# Altium schematic sheet tie-mib-imib.SchDoc: Copper Suicide - Net Tie IMIB
size Letter; CheckedBy: J. Brinton; CompanyName: Signal Laboratories, Inc.; DrawnBy: J. Brinton; Engineer: J. Brinton; Address1: 3479 Edison Way; Address2: Menlo Park CA 94025; Address3: +1 (877) 778-8435; Address4: siglabs.com; Revision: 3; SheetNumber: 30; SheetTotal: 47
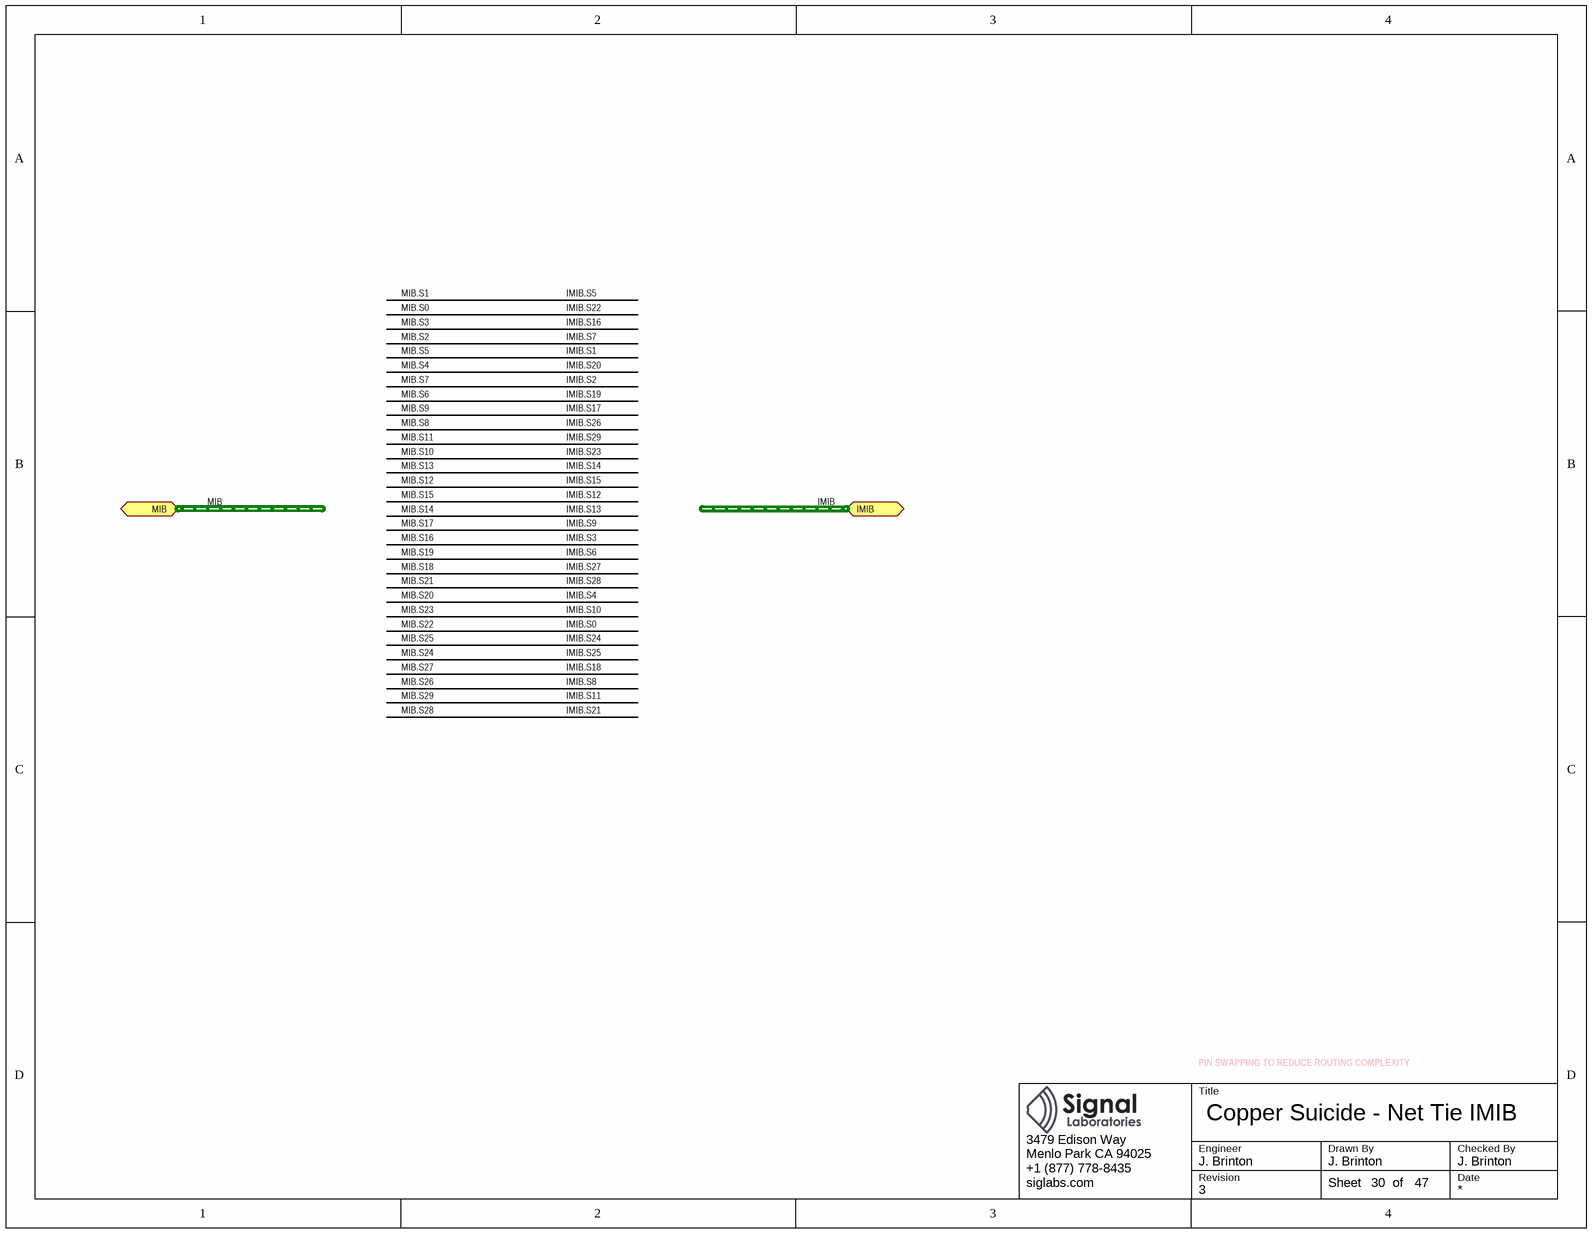
[diagram p0: tie-mib-imib.SchDoc]

## Ports
IMIB (harness MIB), MIB (harness MIB)

## Buses and harness runs
harness IMIB = port IMIB
harness MIB = port MIB

## Notes on the sheet
- PIN SWAPPING TO REDUCE ROUTING COMPLEXITY
- Title
- Engineer
- Revision
- Drawn By
- Checked By
- Date
- Sheet
- of